# EAGLE design soic8_tssop8 (EAGLE 5.11)
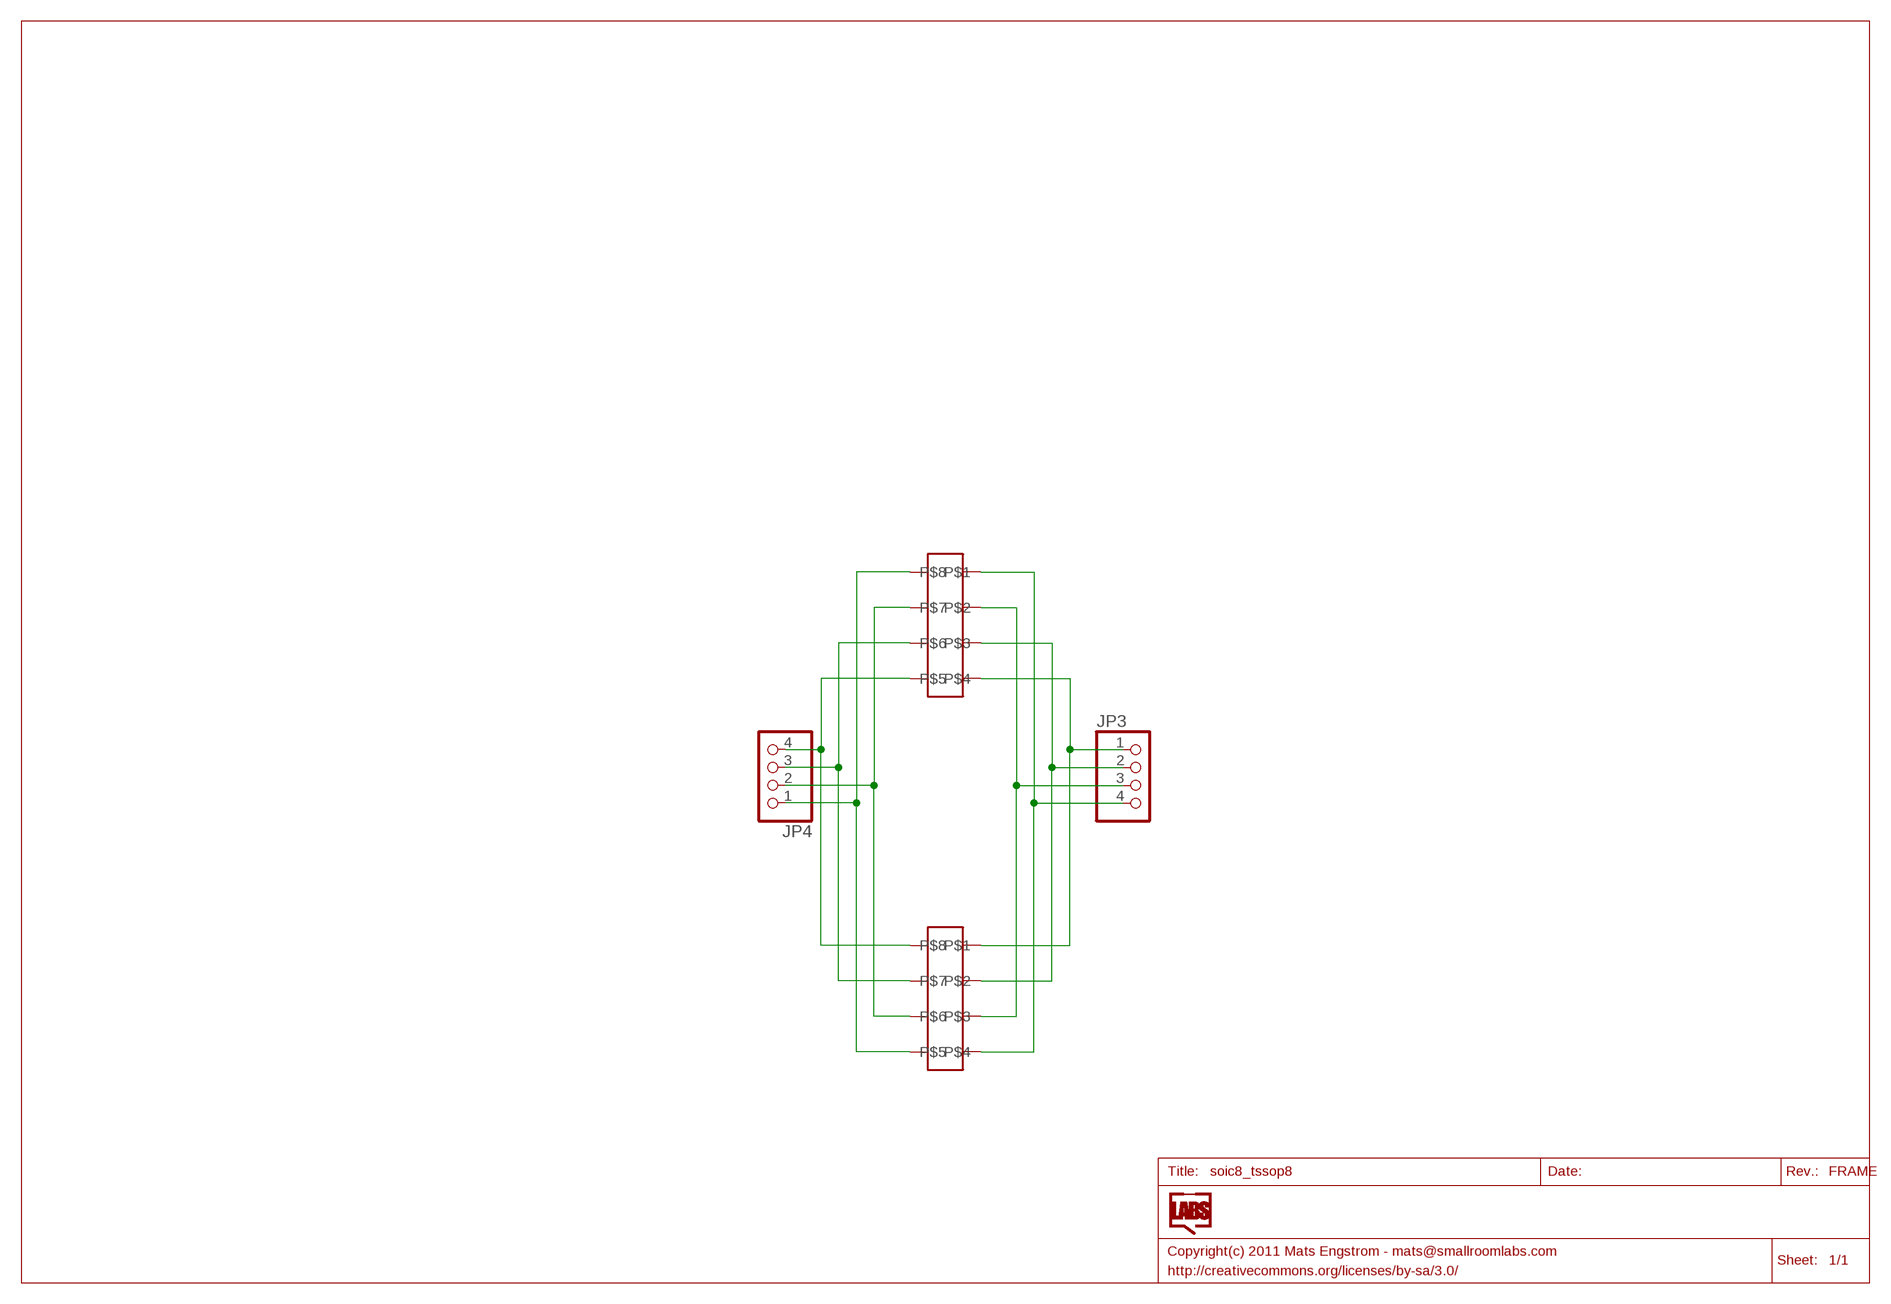
[diagram p0: schematic, sheet 1]

## Parts
IC3  IC8SOIC  [SOIC8]
IC4  IC8TSSOP  [TSSOP8]
JP3  HEADER-1X4ROUND  [1X04_ROUND]
JP4  HEADER-1X4ROUND  [1X04_ROUND]

## Nets
N$9: IC3.4 IC4.1 JP4.4
N$10: IC3.3 IC4.2 JP4.3
N$11: IC3.2 IC4.3 JP4.2
N$12: IC3.1 IC4.4 JP4.1
N$13: IC3.5 IC4.8 JP3.1
N$14: IC3.6 IC4.7 JP3.2
N$15: IC3.7 IC4.6 JP3.3
N$16: IC3.8 IC4.5 JP3.4

## Library data of the parts
IC3 IC4 = SmallRoomLabs:IC8
JP3 JP4 = microbuilder:HEADER-1X4: PIN HEADER

## Net classes
0 default: width 0.178 mm, clearance 0.178 mm

## Board
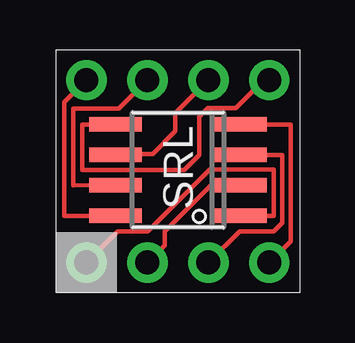
[diagram p1: board, top side]
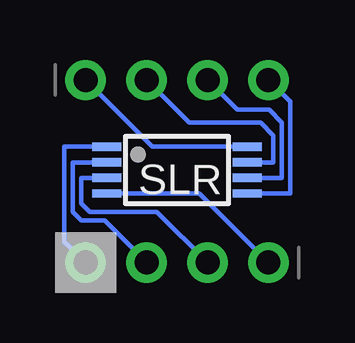
[diagram p2: board, bottom side, seen from below]

No outline drawn. Coordinates in mm, seen from the top.
Copper layers (1*16): Top 0.035mm / dielectric 1.5mm / Bottom 0.035mm
Design rules "Fusion_eagle_rule_v1.1": minimum track width 6mil, minimum drill 12mil, track to track 6mil, track to pad 6mil, pad to pad 6mil, via to via 6mil, smd to smd 0mil, copper to edge 10mil, drill to drill 10mil, minimum pad ring 10mil, minimum via ring 6mil, stop-mask expansion 2mil, vias tented up to drill 100mil, thermal gap 10mil

### Footprints (pad centres in the part's own frame; a part is rotated, then mirrored left to right if it is on the bottom)
SOIC8 = smd 0.6 x 2.2: 1 -1.905,-2.6; 2 -0.635,-2.6; 3 0.635,-2.6; 4 1.905,-2.6; 5 1.905,2.6; 6 0.635,2.6; 7 -0.635,2.6; 8 -1.905,2.6
TSSOP8 = smd 1.2 x 0.35: 1 -2.925,0.975; 2 -2.925,0.325; 3 -2.925,-0.325; 4 -2.925,-0.975; 5 2.925,-0.975; 6 2.925,-0.325; 7 2.925,0.325; 8 2.925,0.975
1X04_ROUND = drill 1 pad 1.676 round: 1 -3.81,0; 2 -1.27,0; 3 1.27,0; 4 3.81,0

### Placement (x,y rotation side)
IC3  5.08,5.13 90 top
IC4  5.08,5.13 0 bottom
JP3  5.08,8.89 0 bottom
JP4  5.08,1.27 180 bottom

### Tracks (layer width: path | path; a pad name or v marks a point on that pad's centre or on a via)
N$9
  Top 0.178: IC3.4 9.78,7.04 9.78,2.16 JP4.4
  Bottom 0.178: IC4.1 9.78,6.11 9.78,2.13 9.58,1.96 JP4.4
N$10
  Top 0.178: IC3.3 9.42,5.77 9.42,2.93 9.07,2.58 7.66,2.58 JP4.3
  Bottom 0.178: IC4.2 9.42,5.46 9.42,3.38 9.07,3.02 8.1,3.02 JP4.3
N$11
  Top 0.178: IC3.2 6.45,4.5 4.53,2.58 4.53,1.99 JP4.2
  Bottom 0.178: IC4.3 9.06,4.81 9.07,4.8 9.07,3.73 8.71,3.38 5.92,3.38 JP4.2
N$12
  Top 0.178: IC3.1 9.07,3.23 9.07,5.16 6.4,5.16 3.82,2.58 2.58,2.58 JP4.1
  Bottom 0.178: IC4.4 4.16,4.16 JP4.1
N$13
  Top 0.178: IC3.5 1.09,7.04 1.09,5.13 5.33,5.13 5.97,5.77 5.97,7.37 6.33,7.72 7.49,7.72 8.66,8.89 JP3.1
  Bottom 0.178: IC4.8 6.11,6.11 JP3.1
N$14
  Top 0.178: IC3.6 2.5,5.8 4.02,5.8 4.98,6.76 4.98,7.52 JP3.2
  Bottom 0.178: IC4.7 1.07,5.46 1.07,6.58 1.6,7.11 4.57,7.11 JP3.2
N$15
  Top 0.178: IC3.7 2.4,4.5 1.9,4.5 0.72,4.49 0.72,7.7 1.3,7.7 2.62,7.7 JP3.3
  Bottom 0.178: IC4.6 0.89,4.81 0.89,4.8 0.71,4.8 0.71,7.11 1.25,7.64 2.56,7.64 JP3.3
N$16
  Top 0.178: JP3.4 0.34,7.96 0.34,3.23 IC3.8
  Bottom 0.178: IC4.5 0.36,4.16 0.36,8 0.38,8 JP3.4

### Text on the board
tPlace: SRL
bPlace: SLR